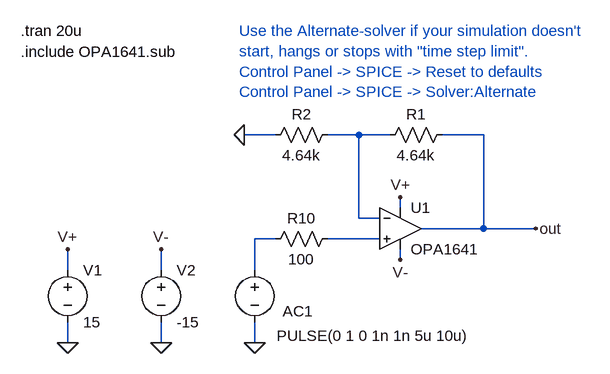
[diagram p0: schematic OPA1641_test.asc]
OPA1641_test.asc, the LTspice schematic file:
Version 4
SHEET 1 3256 1140
WIRE 640 -64 592 -64
WIRE 768 -64 720 -64
WIRE 816 -64 768 -64
WIRE 944 -64 896 -64
WIRE 960 -64 944 -64
WIRE 832 48 832 32
WIRE 768 64 768 -64
WIRE 800 64 768 64
WIRE 960 80 960 -64
WIRE 960 80 864 80
WIRE 1040 80 960 80
WIRE 640 96 608 96
WIRE 800 96 720 96
WIRE 832 128 832 112
WIRE 320 144 320 112
WIRE 464 144 464 112
WIRE 608 144 608 96
WIRE 320 256 320 224
WIRE 464 256 464 224
WIRE 608 256 608 224
FLAG 320 256 0
FLAG 320 112 V+
FLAG 608 256 0
FLAG 832 32 V+
FLAG 464 256 0
FLAG 464 112 V-
FLAG 832 128 V-
FLAG 592 -64 0
FLAG 1040 80 out
DATAFLAG 944 -64 "round($*1k)/1k"
SYMBOL voltage 320 128 R0
WINDOW 123 24 132 Left 0
WINDOW 39 24 132 Left 0
SYMATTR InstName V1
SYMATTR Value 15
SYMBOL voltage 608 128 R0
WINDOW 123 35 185 Left 0
WINDOW 39 27 108 Left 0
WINDOW 3 34 117 Left 0
WINDOW 0 43 79 Left 0
SYMATTR Value PULSE(0 1 0 1n 1n 5u 10u)
SYMATTR InstName AC1
SYMBOL res 736 80 R90
WINDOW 0 0 56 VBottom 0
WINDOW 3 32 56 VTop 0
SYMATTR InstName R10
SYMATTR Value 100
SYMBOL voltage 464 128 R0
WINDOW 123 24 132 Left 0
WINDOW 39 24 132 Left 0
SYMATTR InstName V2
SYMATTR Value -15
SYMBOL Opamps\\opamp2 832 16 R0
SYMATTR InstName U1
SYMATTR Value OPA1641
SYMBOL res 800 -48 R270
WINDOW 0 32 56 VTop 0
WINDOW 3 0 56 VBottom 0
SYMATTR InstName R1
SYMATTR Value 4.64k
SYMBOL res 624 -48 R270
WINDOW 0 32 56 VTop 0
WINDOW 3 0 56 VBottom 0
SYMATTR InstName R2
SYMATTR Value 4.64k
TEXT 248 -224 Left 0 !.tran 20u
TEXT 248 -192 Left 0 !.include OPA1641.sub
TEXT 584 -224 Left 0 ;Use the Alternate-solver if your simulation doesn't \nstart, hangs or stops with "time step limit".\nControl Panel -> SPICE -> Reset to defaults\nControl Panel -> SPICE -> Solver:Alternate

The netlist it stands for:
* OPA1641_test.asc
V1 V+ 0 15
V§AC1 N002 0 PULSE(0 1 0 1n 1n 5u 10u)
R10 N003 N002 100
V2 V- 0 -15
XU1 N003 N001 V+ V- out OPA1641  ; pins In+ In- V+ V- OUT
R1 N001 out 4.64k
R2 0 N001 4.64k
.tran 20u
.include OPA1641.sub
* Use the Alternate-solver if your simulation doesn't
* start, hangs or stops with "time step limit".
* Control Panel -> SPICE -> Reset to defaults
* Control Panel -> SPICE -> Solver:Alternate
.backanno
.end